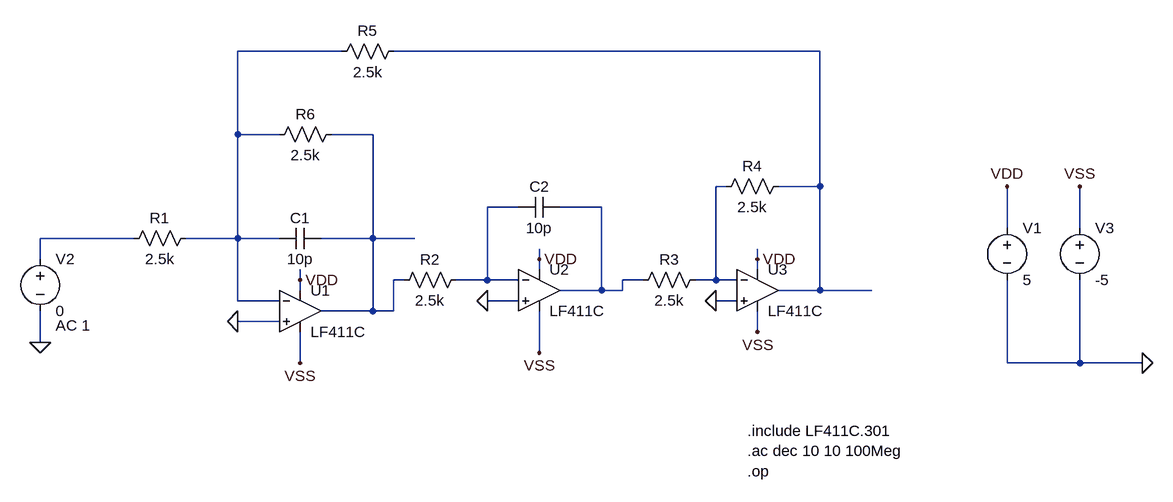
[diagram p0: schematic Draft14.asc]
Draft14.asc, the LTspice schematic file:
Version 4
SHEET 1 1648 708
WIRE 400 64 240 64
WIRE 1136 64 480 64
WIRE 240 192 240 64
WIRE 304 192 240 192
WIRE 448 192 384 192
WIRE 992 272 976 272
WIRE 1136 272 1136 64
WIRE 1136 272 1072 272
WIRE 672 304 624 304
WIRE 800 304 736 304
WIRE 1424 336 1424 272
WIRE 1536 336 1536 272
WIRE 80 352 -64 352
WIRE 240 352 240 192
WIRE 240 352 160 352
WIRE 304 352 240 352
WIRE 448 352 448 192
WIRE 448 352 368 352
WIRE 512 352 448 352
WIRE -64 384 -64 352
WIRE 704 384 704 368
WIRE 1040 384 1040 368
WIRE 704 400 704 384
WIRE 1040 400 1040 384
WIRE 336 416 336 400
WIRE 496 416 480 416
WIRE 624 416 624 304
WIRE 624 416 576 416
WIRE 672 416 624 416
WIRE 864 416 832 416
WIRE 976 416 976 272
WIRE 976 416 944 416
WIRE 1008 416 976 416
WIRE 336 432 336 416
WIRE 800 432 800 304
WIRE 800 432 736 432
WIRE 832 432 832 416
WIRE 832 432 800 432
WIRE 1136 432 1136 272
WIRE 1136 432 1072 432
WIRE 1216 432 1136 432
WIRE 240 448 240 352
WIRE 304 448 240 448
WIRE 672 448 624 448
WIRE 1008 448 976 448
WIRE 448 464 448 352
WIRE 448 464 368 464
WIRE 480 464 480 416
WIRE 480 464 448 464
WIRE 304 480 240 480
WIRE 1040 496 1040 464
WIRE -64 512 -64 464
WIRE 704 528 704 464
WIRE 336 544 336 496
WIRE 1424 544 1424 416
WIRE 1536 544 1536 416
WIRE 1536 544 1424 544
WIRE 1632 544 1536 544
FLAG 240 480 0
FLAG 624 448 0
FLAG 976 448 0
FLAG 1040 496 VSS
FLAG 704 528 VSS
FLAG 336 544 VSS
FLAG 336 416 VDD
FLAG 704 384 VDD
FLAG 1040 384 VDD
FLAG 1424 272 VDD
FLAG -64 512 0
FLAG 1632 544 0
FLAG 1536 272 VSS
SYMBOL res 176 336 R90
WINDOW 0 0 56 VBottom 2
WINDOW 3 32 56 VTop 2
SYMATTR InstName R1
SYMATTR Value 2.5k
SYMBOL cap 368 336 R90
WINDOW 0 0 32 VBottom 2
WINDOW 3 32 32 VTop 2
SYMATTR InstName C1
SYMATTR Value 10p
SYMBOL cap 736 288 R90
WINDOW 0 0 32 VBottom 2
WINDOW 3 32 32 VTop 2
SYMATTR InstName C2
SYMATTR Value 10p
SYMBOL res 592 400 R90
WINDOW 0 0 56 VBottom 2
WINDOW 3 32 56 VTop 2
SYMATTR InstName R2
SYMATTR Value 2.5k
SYMBOL res 960 400 R90
WINDOW 0 0 56 VBottom 2
WINDOW 3 32 56 VTop 2
SYMATTR InstName R3
SYMATTR Value 2.5k
SYMBOL res 1088 256 R90
WINDOW 0 0 56 VBottom 2
WINDOW 3 32 56 VTop 2
SYMATTR InstName R4
SYMATTR Value 2.5k
SYMBOL res 496 48 R90
WINDOW 0 0 56 VBottom 2
WINDOW 3 32 56 VTop 2
SYMATTR InstName R5
SYMATTR Value 2.5k
SYMBOL res 400 176 R90
WINDOW 0 0 56 VBottom 2
WINDOW 3 32 56 VTop 2
SYMATTR InstName R6
SYMATTR Value 2.5k
SYMBOL OpAmps/opamp2 336 400 R0
SYMATTR InstName U1
SYMATTR Value LF411C
SYMBOL OpAmps/opamp2 704 368 R0
SYMATTR InstName U2
SYMATTR Value LF411C
SYMBOL OpAmps/opamp2 1040 368 R0
SYMATTR InstName U3
SYMATTR Value LF411C
SYMBOL voltage 1424 320 R0
SYMATTR InstName V1
SYMATTR Value 5
SYMBOL voltage -64 368 R0
WINDOW 123 24 118 Left 2
SYMATTR InstName V2
SYMATTR Value 0
SYMATTR Value2 AC 1
SYMBOL voltage 1536 320 R0
SYMATTR InstName V3
SYMATTR Value -5
TEXT 1024 648 Left 2 !.include LF411C.301\n.ac dec 10 10 100Meg\n.op

The netlist it stands for:
* Draft14.asc
R1 N001 N007 2.5k
C1 N003 N001 10p
C2 N006 N005 10p
R2 N005 N003 2.5k
R3 N004 N006 2.5k
R4 N002 N004 2.5k
R5 N002 N001 2.5k
R6 N003 N001 2.5k
XU1 0 N001 VDD VSS N003 LF411C  ; pins In+ In- V+ V- OUT
XU2 0 N005 VDD VSS N006 LF411C  ; pins In+ In- V+ V- OUT
XU3 0 N004 VDD VSS N002 LF411C  ; pins In+ In- V+ V- OUT
V1 VDD 0 5
V2 N007 0 0 AC 1
V3 VSS 0 -5
.include LF411C.301
.ac dec 10 10 100Meg
.op
.backanno
.end